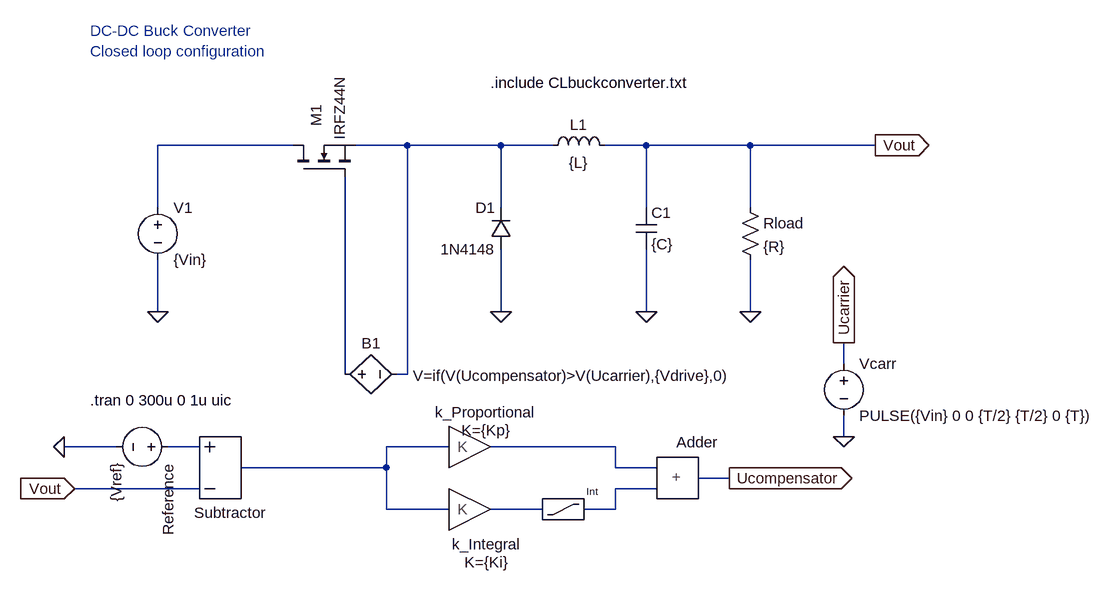
[diagram p0: schematic CLbuckconverter.asc]
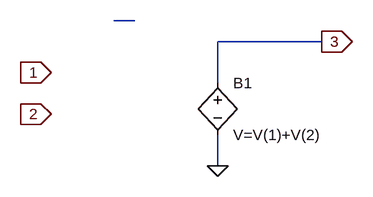
[diagram p1: sub-circuit adder.asc]
CLbuckconverter.asc, the LTspice schematic file:
Version 4
SHEET 1 1668 720
WIRE 256 -64 48 -64
WIRE 432 -64 352 -64
WIRE 576 -64 432 -64
WIRE 656 -64 576 -64
WIRE 800 -64 736 -64
WIRE 960 -64 800 -64
WIRE 1152 -64 960 -64
WIRE 48 32 48 -64
WIRE 576 32 576 -64
WIRE 800 32 800 -64
WIRE 960 32 960 -64
WIRE 48 192 48 112
WIRE 576 192 576 96
WIRE 800 192 800 96
WIRE 960 192 960 112
WIRE 1104 272 1104 240
WIRE 336 288 336 -16
WIRE 432 288 432 -64
WIRE 432 288 416 288
WIRE 1104 384 1104 352
WIRE -16 400 -96 400
WIRE 112 400 64 400
WIRE 496 400 400 400
WIRE 752 400 560 400
WIRE 400 432 400 400
WIRE 400 432 176 432
WIRE 752 432 752 400
WIRE 816 432 752 432
WIRE 928 448 880 448
WIRE 112 464 -80 464
WIRE 816 464 752 464
WIRE 400 496 400 432
WIRE 496 496 400 496
WIRE 640 496 560 496
WIRE 752 496 752 464
WIRE 752 496 704 496
FLAG 576 192 0
FLAG 800 192 0
FLAG 960 192 0
FLAG 48 192 0
FLAG 1152 -64 Vout
IOPIN 1152 -64 Out
FLAG -80 464 Vout
IOPIN -80 464 In
FLAG 928 448 Ucompensator
IOPIN 928 448 Out
FLAG -96 400 0
FLAG 1104 384 0
FLAG 1104 240 Ucarrier
IOPIN 1104 240 Out
SYMBOL voltage 48 16 R0
WINDOW 123 0 0 Left 0
WINDOW 39 0 0 Left 0
SYMATTR InstName V1
SYMATTR Value {Vin}
SYMBOL ind 640 -48 R270
WINDOW 0 32 56 VTop 2
WINDOW 3 5 56 VBottom 2
SYMATTR InstName L1
SYMATTR Value {L}
SYMBOL cap 784 32 R0
SYMATTR InstName C1
SYMATTR Value {C}
SYMBOL res 944 16 R0
SYMATTR InstName Rload
SYMATTR Value {R}
SYMBOL diode 592 96 R180
WINDOW 0 24 64 Left 2
WINDOW 3 24 0 Left 2
SYMATTR InstName D1
SYMATTR Value 1N4148
SYMATTR Description Schottky diode
SYMATTR Type schottky
SYMBOL nmos 256 -16 R270
WINDOW 0 77 36 Left 2
SYMATTR InstName M1
SYMATTR Value IRFZ44N
SYMBOL adder 848 448 R0
WINDOW 0 -2 -55 Left 2
SYMATTR InstName Adder
SYMBOL gain 512 400 R0
WINDOW 0 41 -38 Bottom 2
WINDOW 3 41 -10 Bottom 2
SYMATTR InstName k_Proportional
SYMATTR Value K={Kp}
SYMBOL subtractor 128 400 R0
WINDOW 0 -24 101 Left 2
SYMATTR InstName Subtractor
SYMBOL gain 512 496 R0
WINDOW 0 42 69 Bottom 2
WINDOW 3 42 97 Bottom 2
SYMATTR InstName k_Integral
SYMATTR Value K={Ki}
SYMBOL integral 672 496 R0
SYMATTR InstName Int
SYMBOL voltage 1104 256 R0
WINDOW 123 0 0 Left 0
WINDOW 39 0 0 Left 0
SYMATTR InstName Vcarr
SYMATTR Value PULSE({Vin} 0 0 {T/2} {T/2} 0 {T})
SYMBOL voltage 80 400 R90
WINDOW 123 0 0 Left 0
WINDOW 39 0 0 Left 0
SYMATTR InstName Reference
SYMATTR Value {Vref}
SYMBOL bv 320 288 R270
WINDOW 0 32 56 VTop 2
WINDOW 3 13 367 VBottom 2
SYMATTR InstName B1
SYMATTR Value V=if(V(Ucompensator)>V(Ucarrier),{Vdrive},0)
TEXT -56 -240 Left 2 ;DC-DC Buck Converter\nClosed loop configuration
TEXT 560 -160 Left 2 !.include CLbuckconverter.txt
TEXT -56 328 Left 2 !.tran 0 300u 0 1u uic

adder.asc, the sub-circuit schematic file:
Version 4
SHEET 1 880 680
WIRE 80 48 48 48
WIRE 368 80 208 80
WIRE 208 144 208 80
WIRE 208 272 208 224
FLAG -48 128 1
IOPIN -48 128 In
FLAG -48 192 2
IOPIN -48 192 In
FLAG 208 272 0
FLAG 368 80 3
IOPIN 368 80 Out
SYMBOL bv 208 128 R0
SYMATTR InstName B1
SYMATTR Value V=V(1)+V(2)

The netlist it stands for:
* CLbuckconverter.asc
V1 N001 0 {Vin}
L1 N002 Vout {L}
C1 Vout 0 {C}
Rload Vout 0 {R}
D1 0 N002 1N4148
M1 N001 N003 N002 N002 IRFZ44N
XAdder N006 N007 Ucompensator adder
Xk_Proportional N005 N006 gain K={Kp}  ; pins 1 2
XSubtractor N004 Vout N005 subtract  ; pins 1 2 3
Xk_Integral N005 N008 gain K={Ki}  ; pins 1 2
XInt N008 N007 integral  ; pins 1 2
Vcarr Ucarrier 0 PULSE({Vin} 0 0 {T/2} {T/2} 0 {T})
V§Reference N004 0 {Vref}
B1 N003 N002 V=if(V(Ucompensator)>V(Ucarrier),{Vdrive},0)

* block symbol definitions
.subckt adder 1 2 3
B1 3 0 V=V(1)+V(2)
.ends adder

.model D D
.lib standard.dio
.model NMOS NMOS
.model PMOS PMOS
.lib standard.mos
* DC-DC Buck Converter
* Closed loop configuration
.include CLbuckconverter.txt
.tran 0 300u 0 1u uic
.lib adder.lib
.lib gain.lib
.lib subtractor.lib
.lib integral.lib
.backanno
.end